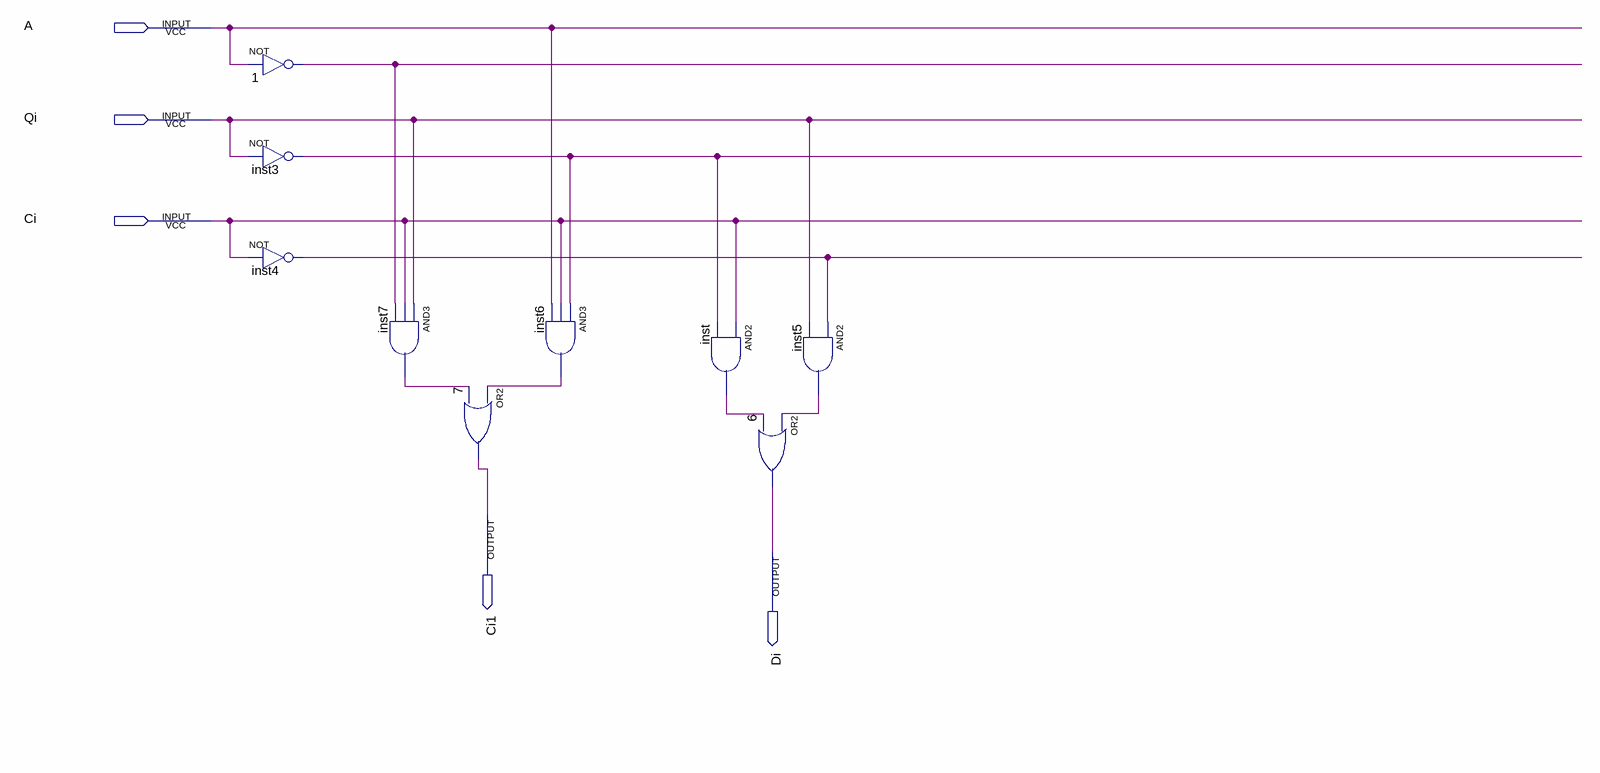
[diagram p0: schematic sheet]
// Quartus schematic HAS.bdf as structural Verilog: 9 symbols, 5 pins
module HAS (
  input  A,
  input  Qi,
  input  Ci,
  output Ci1,
  output Di
);

  wire inst3_out, inst4_out, inst5_out, inst6_out, inst7_out, inst_out, n1_out;

  not u_1 (n1_out, A);
  not inst3 (inst3_out, Qi);
  not inst4 (inst4_out, Ci);
  and inst7 (inst7_out, Qi, Ci, n1_out);
  or u_7 (Ci1, inst6_out, inst7_out);
  and inst6 (inst6_out, inst3_out, Ci, A);
  and inst (inst_out, Ci, inst3_out);
  or u_6 (Di, inst5_out, inst_out);
  and inst5 (inst5_out, inst4_out, Qi);
endmodule
